# EAGLE design SmartCitizen DVK (EAGLE 6.6.0)

## Sheet 1 of 2
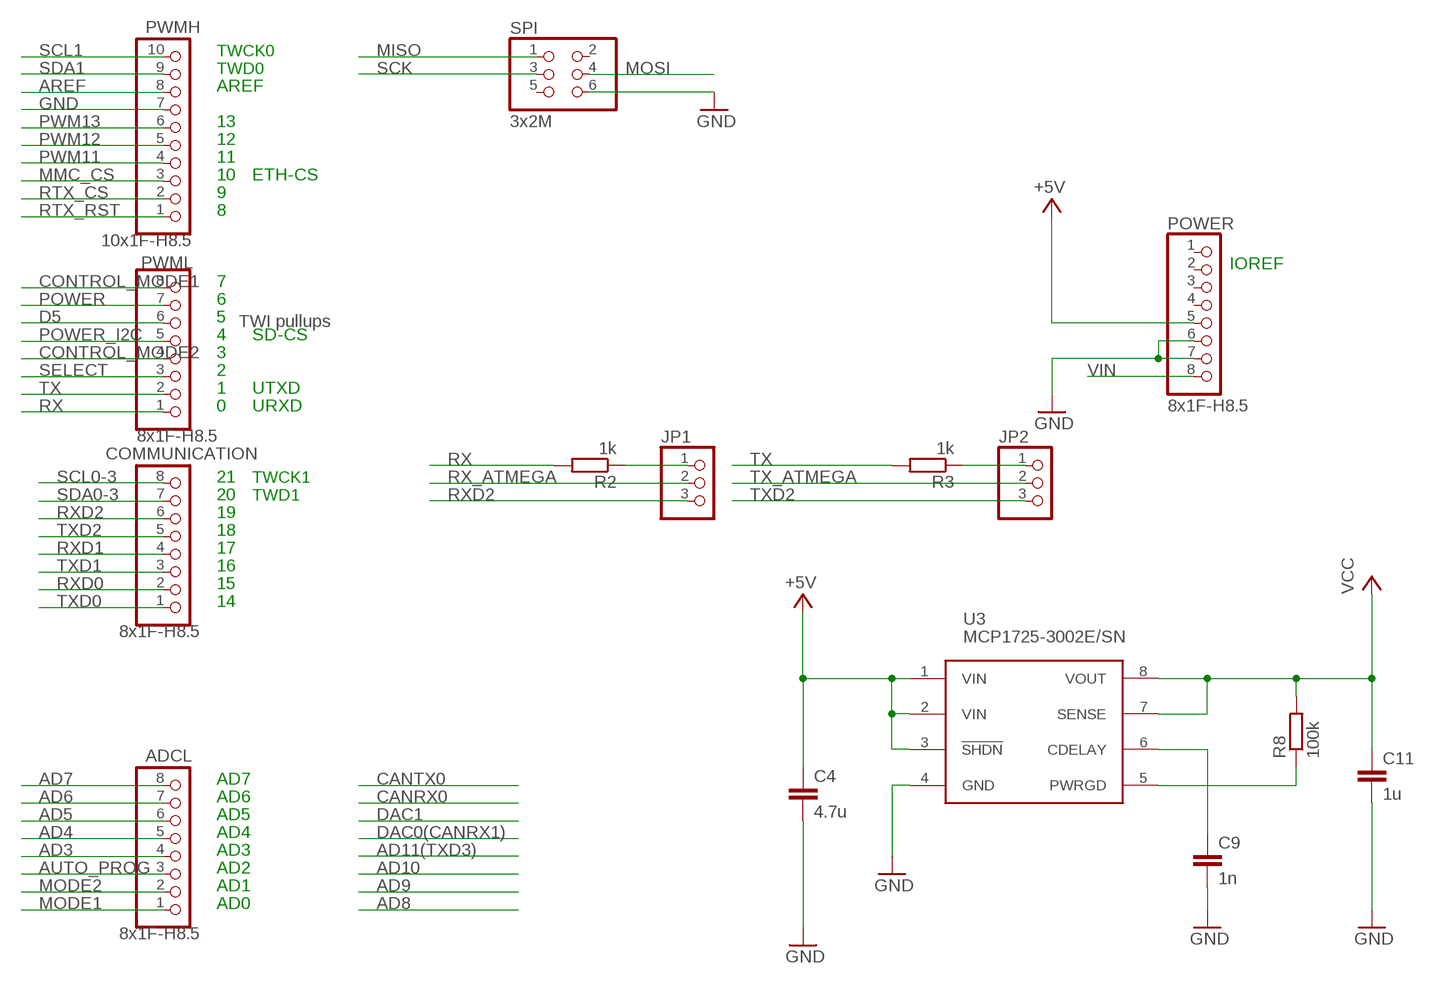
[diagram p0: schematic, sheet 1]

### Parts
ADCL  8x1F-H8.5  PINHD-1X8  [1X08]
C4  4.7u  C-EUC0805  [C0805]
C9  1n  C-EUC0805  [C0805]
C11  1u  C-EUC0805  [C0805]
COMMUNICATION  8x1F-H8.5  PINHD-1X8  [1X08]
JP1  PINHD-1X3  [1X03]
JP2  PINHD-1X3  [1X03]
POWER  8x1F-H8.5  PINHD-1X8  [1X08]
PWMH  10x1F-H8.5  PINHD-1X10  [1X10]
PWML  8x1F-H8.5  PINHD-1X8  [1X08]
R2  1k  R-EU_R0805  [R0805]
R3  1k  R-EU_R0805  [R0805]
R8  100k  R-EU_R0805  [R0805]
SPI  3x2M  PINHD-2X3  [2X03]
U3  MCP1725-3002E/SN  MCP1725  [SOIC8]

### Nets
+5V: C4.1 POWER.5 U3.1(VIN) U3.2(VIN) U3.3(!SHDN) ; also sheet 2
AD3: ADCL.4
AD4: ADCL.5
AD5: ADCL.6
AD6: ADCL.7
AD7: ADCL.8
AREF: PWMH.8
AUTO_PROG: ADCL.3 ; also sheet 2
CONTROL_MODE1: PWML.8 ; also sheet 2
CONTROL_MODE2: PWML.4 ; also sheet 2
D5: PWML.6
GND: C4.2 C9.2 C11.2 POWER.6 POWER.7 PWMH.7 SPI.6 U3.4(GND) ; also sheet 2
MISO: SPI.1 ; also sheet 2
MMC_CS: PWMH.3 ; also sheet 2
MODE1: ADCL.1 ; also sheet 2
MODE2: ADCL.2 ; also sheet 2
MOSI: SPI.4 ; also sheet 2
N$6: JP1.1 R2.1
N$7: JP2.1 R3.1
N$9: C9.1 U3.6(CDELAY)
N$10: R8.1 U3.5(PWRGD)
POWER: PWML.7 ; also sheet 2
POWER_I2C: PWML.5 ; also sheet 2
PWM11: PWMH.4
PWM12: PWMH.5
PWM13: PWMH.6
RTX_CS: PWMH.2 ; also sheet 2
RTX_RST: PWMH.1 ; also sheet 2
RX: PWML.1 R2.2
RX_ATMEGA: JP1.2 ; also sheet 2
RXD0: COMMUNICATION.2
RXD1: COMMUNICATION.4
RXD2: COMMUNICATION.6 JP1.3
SCK: SPI.3 ; also sheet 2
SCL0-3: COMMUNICATION.8
SCL1: PWMH.10 ; also sheet 2
SDA0-3: COMMUNICATION.7
SDA1: PWMH.9 ; also sheet 2
SELECT: PWML.3 ; also sheet 2
TX: PWML.2 R3.2
TX_ATMEGA: JP2.2 ; also sheet 2
TXD0: COMMUNICATION.1
TXD1: COMMUNICATION.3
TXD2: COMMUNICATION.5 JP2.3
VCC [usbvcc]: C11.1 R8.2 U3.7(SENSE) U3.8(VOUT) ; also sheet 2
VIN: POWER.8
Unconnected: POWER.1 POWER.2 POWER.3 POWER.4 SPI.2 SPI.5

### Notes on the sheet
- TWCK0
- TWD0
- AREF
- 13
- 12
- 11
- 10 | ETH-CS
- 9
- 8
- IOREF
- 7
- 6
- 5 | TWI pullups
- 4 | SD-CS
- 3
- 2
- 1 | UTXD
- 0 | URXD
- 21 | TWCK1
- 20 | TWD1
- 19
- 18
- 17
- 16
- 15
- 14
- AD7
- AD6
- AD5
- AD4
- AD3
- AD2
- AD1
- AD0

## Sheet 2 of 2
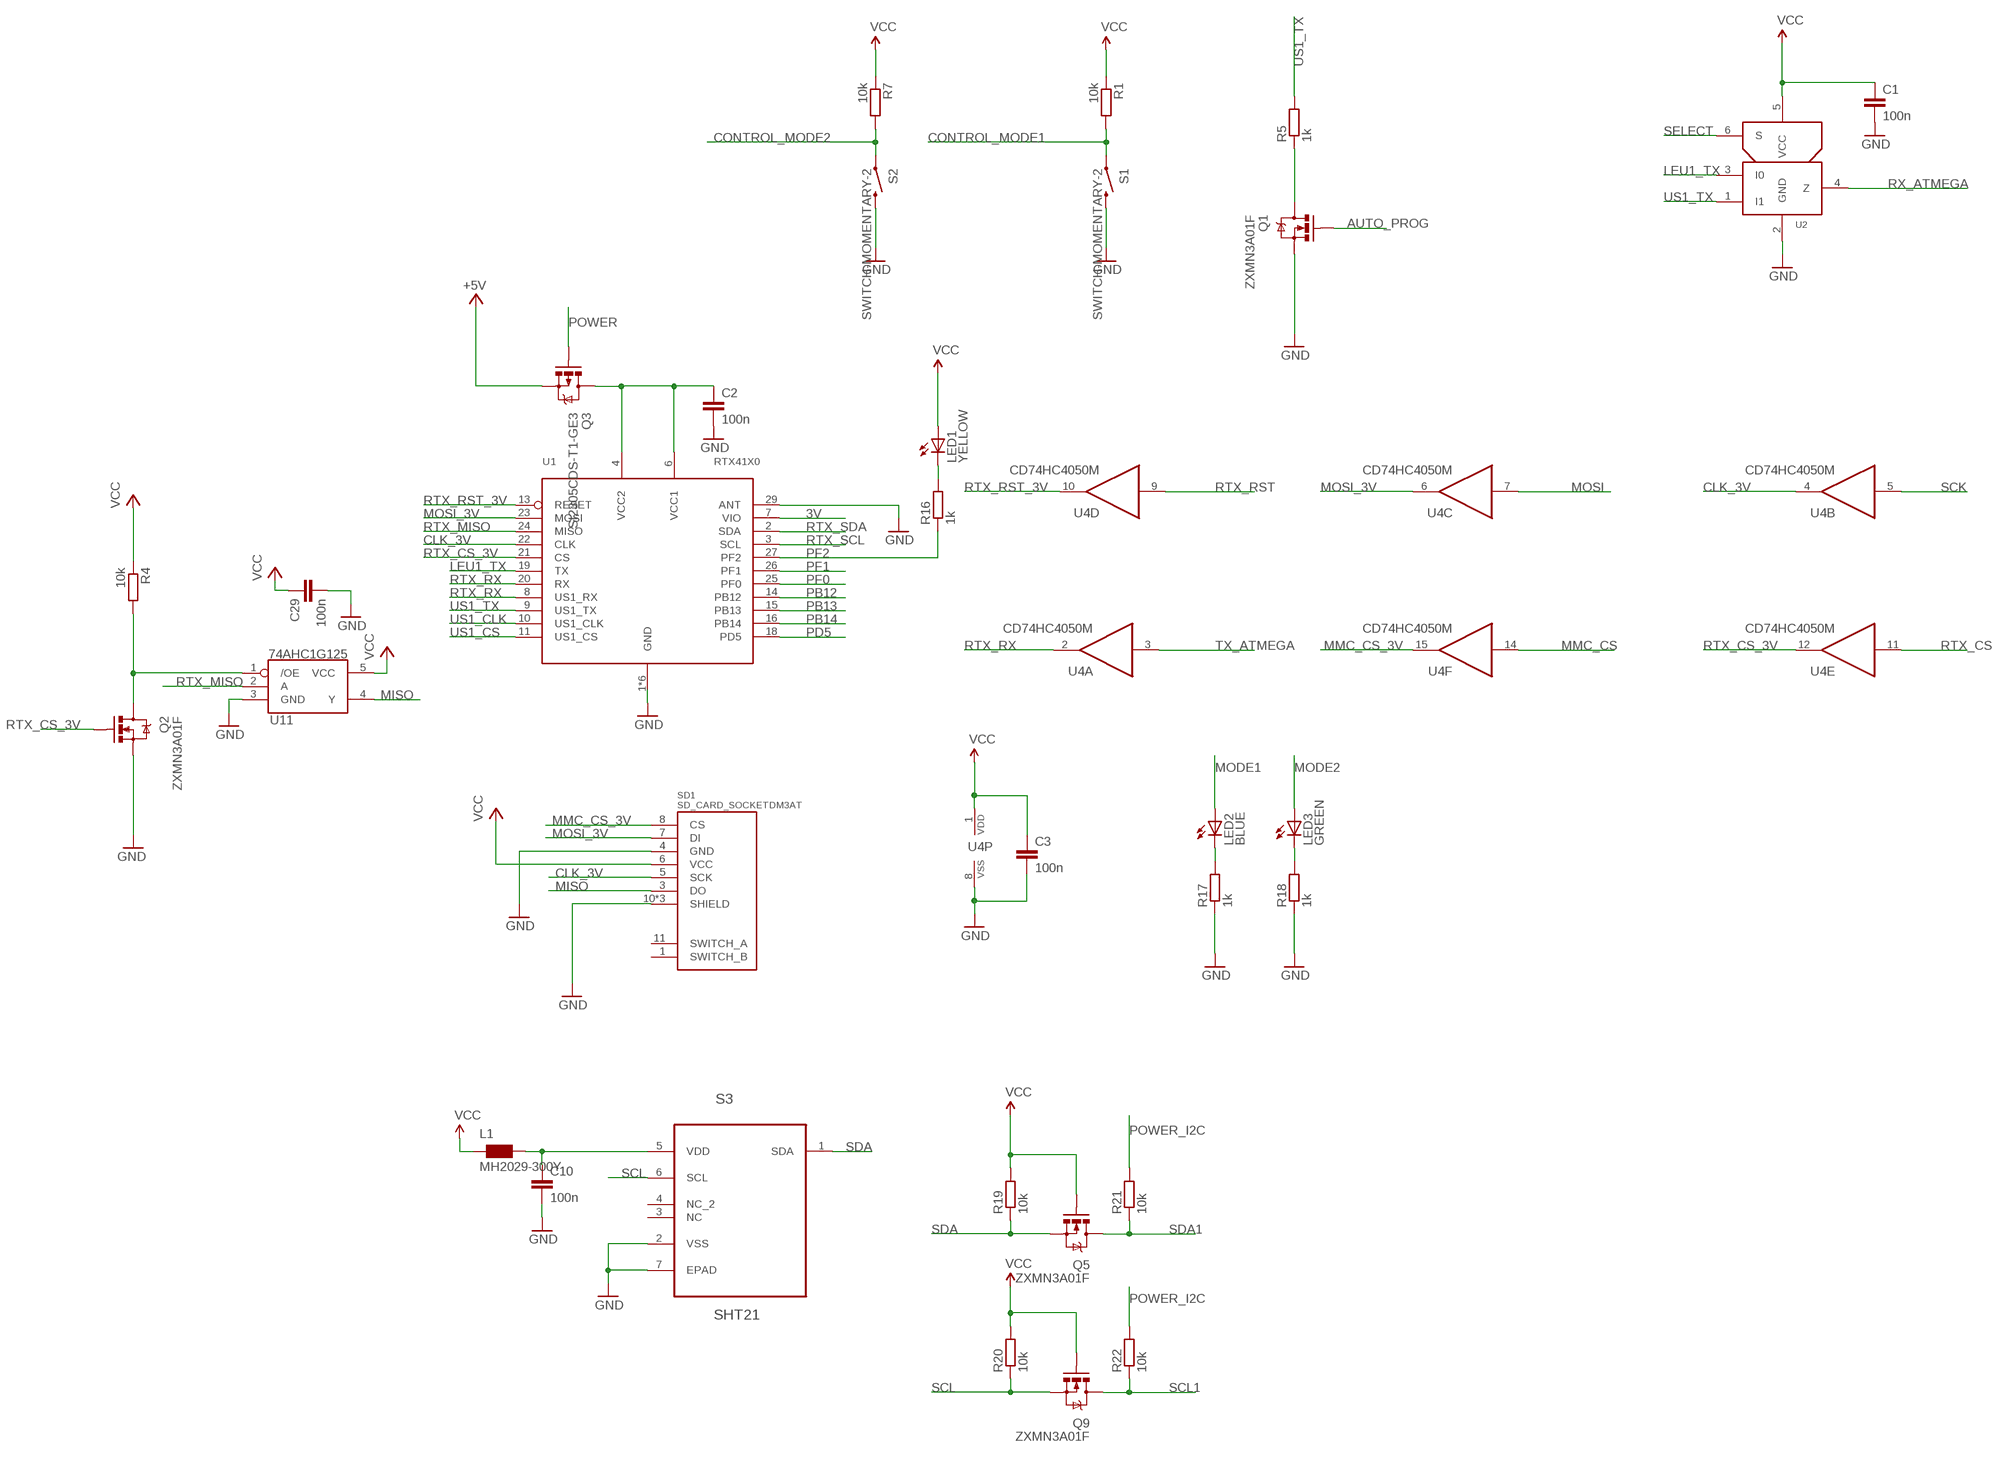
[diagram p1: schematic, sheet 2]

### Parts
C1  100n  C-EUC0805  [C0805]
C2  100n  C-EUC0805  [C0805]
C3  100n  C-EUC0805  [C0805]
C10  100n  C-EUC0805  [C0805]
C29  100n  C-EUC0805  [C0805]
L1  MH2029-300Y  WE-CBF_0805  [0805]
LED1  YELLOW  LEDCHIPLED_0805  [CHIPLED_0805]
LED2  BLUE  LEDCHIPLED_0805  [CHIPLED_0805]
LED3  GREEN  LEDCHIPLED_0805  [CHIPLED_0805]
Q1  ZXMN3A01F  MOSFET-NCHANNELBSS123LT1G  [SOT23]
Q2  ZXMN3A01F  MOSFET-NCHANNELBSS123LT1G  [SOT23]
Q3  SI2305CDS-T1-GE3  MOSFET-PCHANNEL  [SOT23-3]
Q5  ZXMN3A01F  MOSFET-NCHANNELBSS123LT1G  [SOT23]
Q9  ZXMN3A01F  MOSFET-NCHANNELBSS123LT1G  [SOT23]
R1  10k  R-EU_R0805  [R0805]
R4  10k  R-EU_R0805  [R0805]
R5  1k  R-EU_R0805  [R0805]
R7  10k  R-EU_R0805  [R0805]
R16  1k  R-EU_R0805  [R0805]
R17  1k  R-EU_R0805  [R0805]
R18  1k  R-EU_R0805  [R0805]
R19  10k  R-EU_R0805  [R0805]
R20  10k  R-EU_R0805  [R0805]
R21  10k  R-EU_R0805  [R0805]
R22  10k  R-EU_R0805  [R0805]
S1  SWITCH-MOMENTARY-2  [TACTILE_SWITCH_TALL]
S2  SWITCH-MOMENTARY-2  [TACTILE_SWITCH_TALL]
S3  SHT21  [DFN300X300X110-7N]
SD1  SD_CARD_SOCKETDM3AT  [DM3AT]
U1  RTX41X0  [RTX41X0]
U2  NC7SZ157P6X  NC7SV157  [SC70]
U4  CD74HC4050M  4050D  [SO16]
U11  74AHC1G125  [SOT23-5]

### Nets
3V: U1.7(VIO)
+5V: Q3.2(S) ; also sheet 1
AUTO_PROG: Q1.1(G) ; also sheet 1
CLK_3V: SD1.5(SCK) U1.22(CLK) U4.4(B:O)
CONTROL_MODE1: R1.2 S1.A2 ; also sheet 1
CONTROL_MODE2: R7.2 S2.A2 ; also sheet 1
GND: C1.2 C2.2 C3.2 C10.2 C29.2 Q1.2(S) Q2.2(S) R17.1 R18.1 S1.B2 S2.B2 S3.2(VSS) S3.7(EPAD) SD1.4(GND) SD1.10(SHIELD) SD1.12(SHIELD) SD1.13(SHIELD) U1.1(GND) U1.5(GND) U1.12(GND) U1.17(GND) U1.28(GND) U1.29(ANT) U1.30(GND) U2.2(GND) U4.8(P:VSS) U11.3(GND) ; also sheet 1
LEU1_TX: U1.19(TX) U2.3(I0)
MISO: SD1.3(DO) U11.4(Y) ; also sheet 1
MMC_CS: U4.14(F:I) ; also sheet 1
MMC_CS_3V: SD1.8(CS) U4.15(F:O)
MODE1: LED2.A ; also sheet 1
MODE2: LED3.A ; also sheet 1
MOSI: U4.7(C:I) ; also sheet 1
MOSI_3V: SD1.7(DI) U1.23(MOSI) U4.6(C:O)
N$1: Q1.3(D) R5.1
N$2: LED1.C R16.2
N$3: LED2.C R17.2
N$4: LED3.C R18.2
N$5 [usbvcc]: C10.1 L1.2 S3.5(VDD)
N$8: Q2.3(D) R4.2 U11.1(/OE)
PB12: U1.14(PB12)
PB13: U1.15(PB13)
PB14: U1.16(PB14)
PD5: U1.18(PD5)
PF0: U1.25(PF0)
PF1: U1.26(PF1)
PF2: R16.1 U1.27(PF2)
POWER: Q3.1(G) ; also sheet 1
POWER_I2C: R21.2 R22.2 ; also sheet 1
RTX_CS: U4.11(E:I) ; also sheet 1
RTX_CS_3V: Q2.1(G) U1.21(CS) U4.12(E:O)
RTX_MISO: U1.24(MISO) U11.2(A)
RTX_RST: U4.9(D:I) ; also sheet 1
RTX_RST_3V: U1.13(RESET) U4.10(D:O)
RTX_RX: U1.8(US1_RX) U1.20(RX) U4.2(A:O)
RTX_SCL: U1.3(SCL)
RTX_SDA: U1.2(SDA)
RX_ATMEGA: U2.4(Z) ; also sheet 1
SCK: U4.5(B:I) ; also sheet 1
SCL: Q9.2(S) R20.1 S3.6(SCL)
SCL1: Q9.3(D) R22.1 ; also sheet 1
SDA: Q5.2(S) R19.1 S3.1(SDA)
SDA1: Q5.3(D) R21.1 ; also sheet 1
SELECT: U2.6(S) ; also sheet 1
TX_ATMEGA: U4.3(A:I) ; also sheet 1
US1_CLK: U1.10(US1_CLK)
US1_CS: U1.11(US1_CS)
US1_TX: R5.2 U1.9(US1_TX) U2.1(I1)
VCC [usbvcc]: C1.1 C3.1 C29.1 L1.1 LED1.A Q5.1(G) Q9.1(G) R1.1 R4.1 R7.1 R19.2 R20.2 SD1.6(VCC) U2.5(VCC) U4.1(P:VDD) U11.5(VCC) ; also sheet 1
VCC2: C2.1 Q3.3(D) U1.4(VCC2) U1.6(VCC1)
Unconnected: S3.3(NC) S3.4(NC_2) SD1.1(SWITCH_B) SD1.11(SWITCH_A)

### Notes on the sheet
- SD CARD

## Library data of the parts
ADCL COMMUNICATION POWER PWML = SmartPrj:PINHD-1X8: PIN HEADER
C1-C3 = Hangar:C-EU: CAPACITOR, European symbol
C4 C9-C11 C29 = rcl:C-EU: CAPACITOR, European symbol
JP1 JP2 = pinhead:PINHD-1X3: PIN HEADER
L1 = wuerth-elektronik:WE-CBF: SMD EMI Suppression Ferrite Beads - excellent anti-EMI properties - low DCR - impedances till 3000 ohms - rated current up to 6 A
LED1-LED3 = led:LED: LED OSRAM: - CHIPLED LG R971, LG N971, LY N971, LG Q971, LY Q971, LO R971, LY R971 LH N974, LH R974 LS Q976, LO Q976, LY Q976 LO Q996 - Hyper CHIPLED LW Q18S LB Q993, LB Q99A, LB R99A - SideLED LS A670, LO A670, LY A670, LG A670, LP A670 LB A673, LV A673, LT A673, LW A673 LH A674 LY A675 LS A676, LA A676, LO A676, LY A676, LW A676 LS A679, LY A679, LG A679 - Hyper Micro SIDELED® LS Y876, LA Y876, LO Y876, LY Y876 LT Y87S - SmartLED LW L88C, LW L88S LB L89C, LB L89S, LG L890 LS L89K, LO L89K, LY L89K LS L896, LA L896, LO L896, LY L896 - TOPLED LS T670, LO T670, LY T670, LG T670, LP T670 LSG T670, LSP T670, LSY T670, LOP T670, LYG T670 LG T671, LOG T671, LSG T671 LB T673, LV T673, LT T673, LW T673 LH T674 LS T676, LA T676, LO T676, LY T676, LB T676, LH T676, LSB T676, LW T676 LB T67C, LV T67C, LT T67C, LS T67K, LO T67K, LY T67K, LW E67C LS E67B, LA E67B, LO E67B, LY E67B, LB E67C, LV E67C, LT E67C LW T67C LS T679, LY T679, LG T679 LS T770, LO T770, LY T770, LG T770, LP T770 LB T773, LV T773, LT T773, LW T773 LH T774 LS E675, LA E675, LY E675, LS T675 LS T776, LA T776, LO T776, LY T776, LB T776 LHGB T686 LT T68C, LB T68C - Hyper Mini TOPLED® LB M676 - Mini TOPLED Santana® LG M470 LS M47K, LO M47K, LY M47K Source: http://www.osram.convergy.de LUXEON: - LUMILED® LXK2-PW12-R00, LXK2-PW12-S00, LXK2-PW14-U00, LXK2-PW14-V00 LXK2-PM12-R00, LXK2-PM12-S00, LXK2-PM14-U00 LXK2-PE12-Q00, LXK2-PE12-R00, LXK2-PE12-S00, LXK2-PE14-T00, LXK2-PE14-U00 LXK2-PB12-K00, LXK2-PB12-L00, LXK2-PB12-M00, LXK2-PB14-N00, LXK2-PB14-P00, LXK2-PB14-Q00 LXK2-PR12-L00, LXK2-PR12-M00, LXK2-PR14-Q00, LXK2-PR14-R00 LXK2-PD12-Q00, LXK2-PD12-R00, LXK2-PD12-S00 LXK2-PH12-R00, LXK2-PH12-S00 LXK2-PL12-P00, LXK2-PL12-Q00, LXK2-PL12-R00 Source: www.luxeon.com KINGBRIGHT: KA-3528ASYC Source: www.kingbright.com
PWMH = SmartPrj:PINHD-1X10: PIN HEADER
Q1 Q2 Q5 Q9 = SparkFun-DiscreteSemi:MOSFET-NCHANNEL: Common NMOSFET Parts MFG P/N Store ID Prod ID FDD8780 TRANS-09984 SI7820DN TRANS-11055 FDS6630A IC-08089 2N7002PW TRANS-11151 FQP30N06L COM-10213 TRANS-10060 BSS123LT1G TRANS-08345 BSS138 TRANS-00830 BS170 2N7000; PROD_ID: TRANS-08345
Q3 = SparkFun-DiscreteSemi:MOSFET-PCHANNEL: Generic PMOSFET IRLML2244 - TRANS-11153 (SOT-23 -20V -4.3A) (1.Gate 2.Source 3.Drain) FQP27P06 - COM-10349 <http://www.sparkfun.com/products/10349> (TO-220 -60V -27A) (1.Gate 2.Source 3.Drain); PROD_ID: TRANS-08285
R1-R5 R7 R8 R16-R22 = rcl:R-EU_: RESISTOR, European symbol
S1 S2 = Hangar:SWITCH-MOMENTARY-2
S3 = Hangar:SHT21: SENSOR, HUMIDITY & TEMP; MPN: SHT21; OC_FARNELL: 1855468; OC_NEWARK: 20T1172; PACKAGE: DFN-6; SUPPLIER: SENSIRION
SD1 = Hangar:SD_CARD_SOCKET: SD/MMC Socket Media socket for SD and MMC cards. Push-push type. Model MOLEX 503182-0853
SPI = SmartPrj:PINHD-2X3: PIN HEADER
U1 = Hangar:RTX41X0
U2 = Hangar:NC7SV157
U3 = Hangar:MCP1725
U4 = 40xx:4050: Hex non-inverting BUFFER
U11 = SparkFun-DigitalIC:74AHC1G125: Single bus buffer gate with 3-state output

## Net classes
0 Default: width 0.254 mm
1 power: width 0.406 mm, drill 0.6 mm, clearance 0.203 mm
2 gnd: width 0.203 mm, drill 0.406 mm, clearance 0.203 mm
3 usbvcc: width 0.254 mm, drill 0.6 mm, clearance 0.203 mm
4 USBpair: width 0.254 mm, drill 0.406 mm, clearance 0.61 mm

## Board
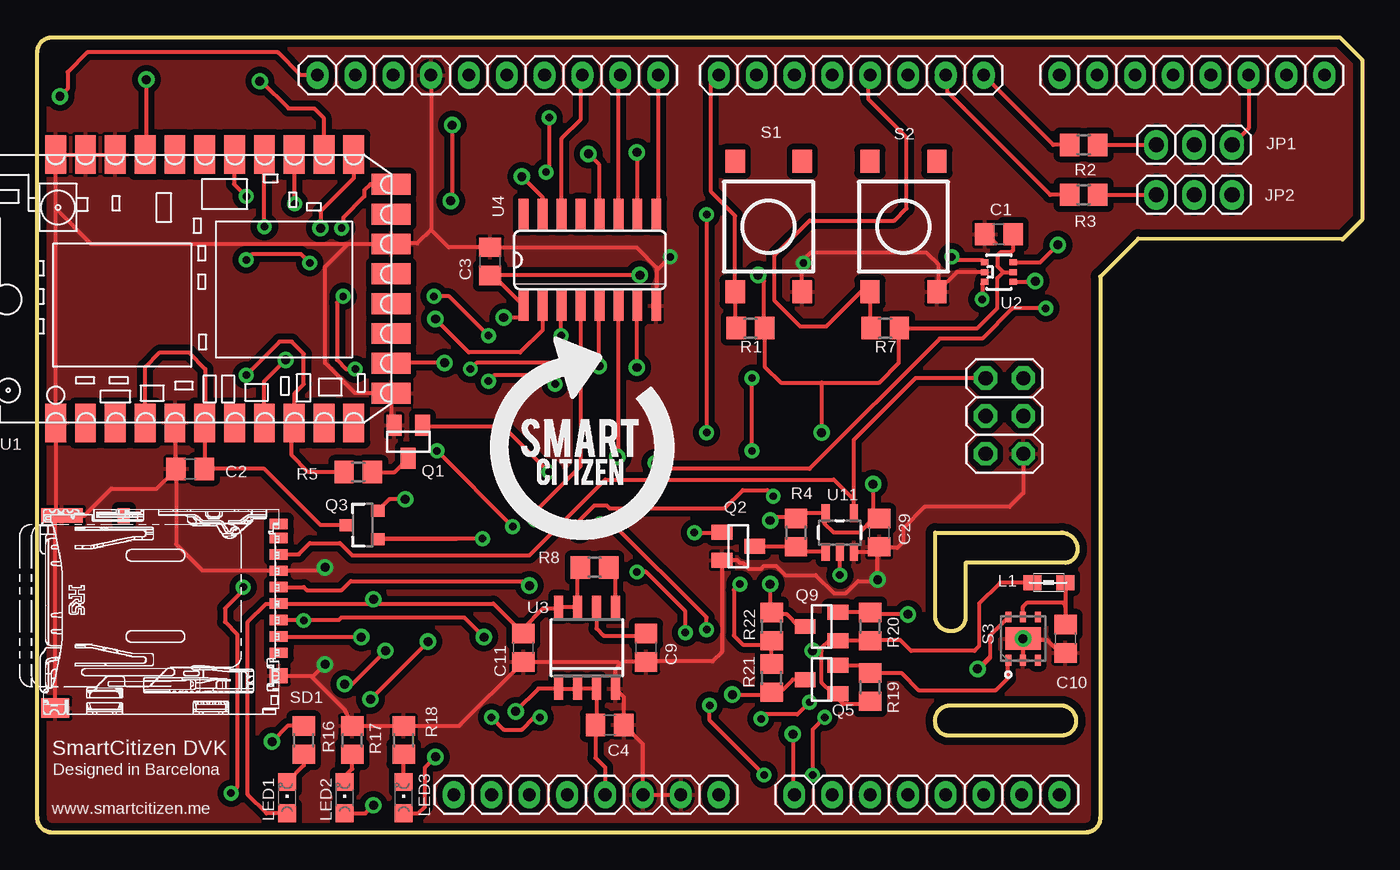
[diagram p2: board, top side]
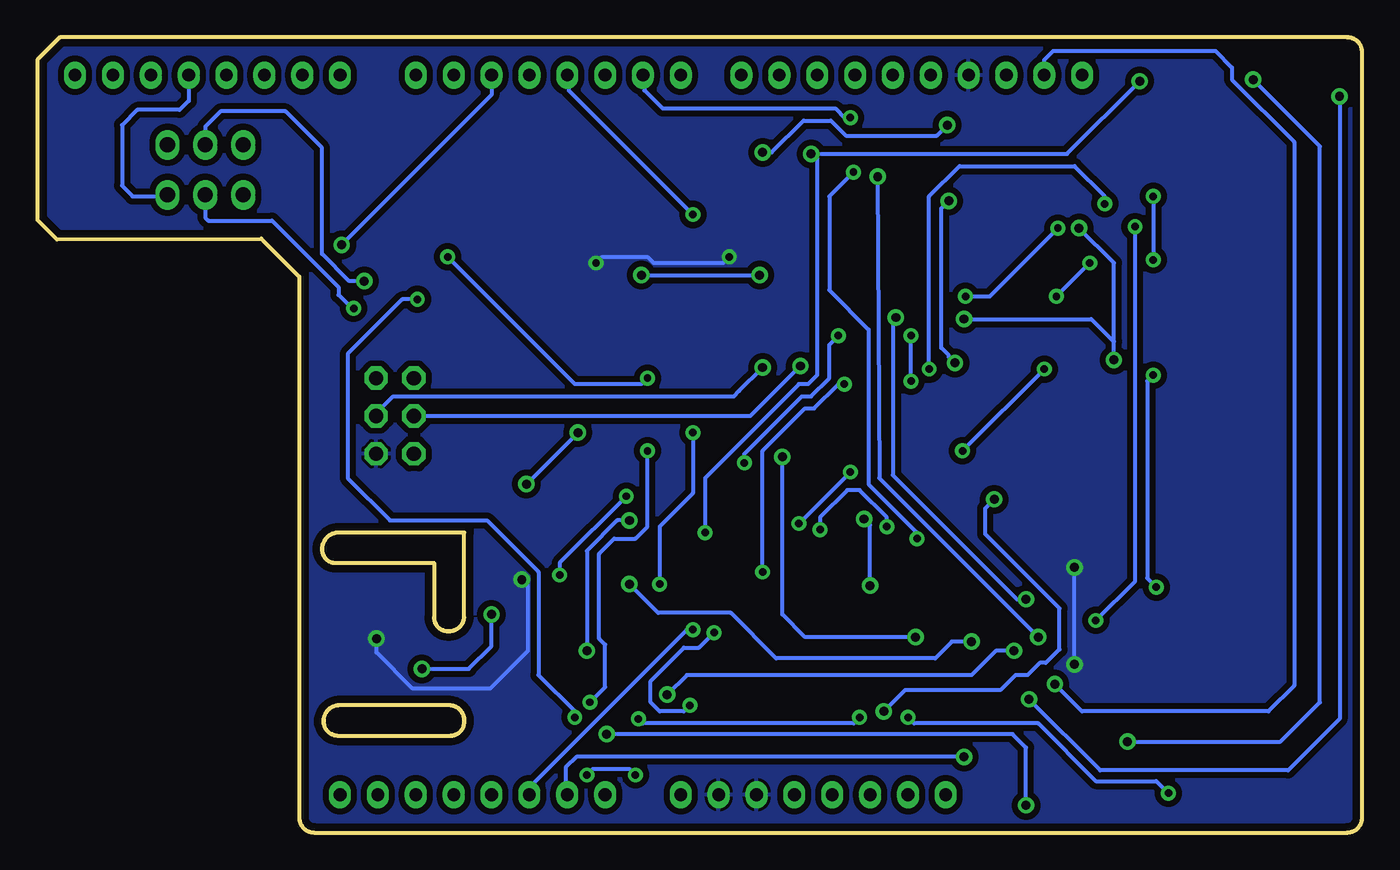
[diagram p3: board, bottom side, seen from below]

Size 88.9 x 53.34 mm. Coordinates in mm from the lower left corner, seen from the top.
Outline: 87.38,53.34 88.9,51.82 88.9,41.1 87.58,39.78 73.86,39.83 71.32,37.29 71.32,1 arc-90 70.32,0 1,0 arc-90 0,1 0,52.34 arc-90 1,53.34 87.38,53.34
Outline: 68.78,6.5 61.16,6.5 arc-90 60.25,7.42 arc-90 61.16,8.53 68.68,8.53 arc-90 69.7,7.42 arc-83 68.78,6.5
Outline: 68.99,18.09 62.28,18.09 62.28,14.43 arc-90 61.37,13.51 arc-90 60.25,14.43 60.25,20.12 68.68,20.12 arc-90 69.8,19 arc-83 68.99,18.09
Copper layers (1*16): Top 0.035mm / dielectric 1.6mm / Bottom 0.035mm
Design rules "default *": minimum track width 10mil, minimum drill 0.5mm, track to track 16mil, track to pad 16mil, pad to pad 16mil, via to via 16mil, smd to smd 16mil, copper to edge 20mil, drill to drill 12mil, minimum pad ring 12mil, minimum via ring 0.25mm, stop-mask expansion 2mil, vias tented up to drill 25mil, thermal gap 8mil

### Footprints (pad centres in the part's own frame; a part is rotated, then mirrored left to right if it is on the bottom)
1X08 = drill 0.85 pad 1.422 long: 1 -8.89,0; 2 -6.35,0; 3 -3.81,0; 4 -1.27,0; 5 1.27,0; 6 3.81,0; 7 6.35,0; 8 8.89,0
C0805 = smd 1.3 x 1.5: 1 -0.95,0; 2 0.95,0
1X03 = drill 1.016 long: 1 -2.54,0; 2 0,0; 3 2.54,0
0805 = smd 1.2 x 1: 1 -1.1,0; 2 1.1,0
CHIPLED_0805 = smd 1.2 x 1.2: A 0,-1.05; C 0,1.05
1X10 = drill 0.85 pad 1.422 long: 1 -11.43,0; 2 -8.89,0; 3 -6.35,0; 4 -3.81,0; 5 -1.27,0; 6 1.27,0; 7 3.81,0; 8 6.35,0; 9 8.89,0; 10 11.43,0
SOT23 = smd 1 x 1.4: 1 -0.95,-1.1; 2 0.95,-1.1; 3 0,1.1
SOT23-3 = smd 0.8 x 0.9: 1 -0.95,-1; 2 0.95,-1; 3 0,1.1
R0805 = smd 1.3 x 1.5: 1 -0.95,0; 2 0.95,0
TACTILE_SWITCH_TALL = smd 1.55 x 1.3: A1 -4.375,-2.25; A2 4.375,-2.25; B1 -4.375,2.25; B2 4.375,2.25
DFN300X300X110-7N = smd 0.711 x 0.406: 1 -1.448,0.991; 2 -1.448,0; 3 -1.448,-0.991; 4 1.448,-0.991; 5 1.448,0; 6 1.448,0.991 | smd 1.499 x 2.388: 7 0,0
DM3AT = smd 0.7 x 1.2: 1 -5.875,7.975; 2 -4.925,7.975; 3 -3.825,7.975; 4 -2.725,7.975; 5 -1.625,7.975; 6 -0.525,7.975; 7 0.575,7.975; 8 1.675,7.975; 9 2.775,7.975 | smd 1 x 1.2: 10 4.33,7.975 | smd 1 x 0.8: 11 -6.425,-2.425 | smd 1 x 2.8: 12 -6.43,-6.575 | smd 1.3 x 1.9: 13 6.49,-7.02
2X03 = drill 0.95 pad 1.55 octagon: 1 -2.54,-1.27; 2 -2.54,1.27; 3 0,-1.27; 4 0,1.27; 5 2.54,-1.27; 6 2.54,1.27
RTX41X0 = smd 1.4 x 2.6: 1 7.5,9; 2 5.5,9; 3 3.5,9; 4 1.5,9; 5 -0.5,9; 6 -2.5,9; 7 -4.5,9; 8 -6.5,9; 9 -8.5,9; 10 -10.5,9; 11 -12.5,9; 20 -12.5,-9; 21 -10.5,-9; 22 -8.5,-9; 23 -6.5,-9; 24 -4.5,-9; 25 -2.5,-9; 26 -0.5,-9; 27 1.5,-9; 28 3.5,-9; 29 5.5,-9; 30 7.5,-9 | smd 2.6 x 1.4: 12 -15,7; 13 -15,5; 14 -15,3; 15 -15,1; 16 -15,-1; 17 -15,-3; 18 -15,-5; 19 -15,-7
SC70 = smd 0.4 x 0.5: 1 -0.65,-0.95; 2 0,-0.95; 3 0.65,-0.95; 4 0.65,0.95; 5 0,0.95; 6 -0.65,0.95
SOIC8 = smd 0.6 x 1.5: 1 -1.905,-2.75; 2 -0.635,-2.75; 3 0.635,-2.75; 4 1.905,-2.75; 5 1.905,2.75; 6 0.635,2.75; 7 -0.635,2.75; 8 -1.905,2.75
SO16 = smd 0.66 x 2.032: 1 -4.445,-3.073; 2 -3.175,-3.073; 3 -1.905,-3.073; 4 -0.635,-3.073; 5 0.635,-3.073; 6 1.905,-3.073; 7 3.175,-3.073; 8 4.445,-3.073; 9 4.445,3.073; 10 3.175,3.073; 11 1.905,3.073; 12 0.635,3.073; 13 -0.635,3.073; 14 -1.905,3.073; 15 -3.175,3.073; 16 -4.445,3.073
SOT23-5 = smd 0.55 x 1.2: 1 -0.95,-1.3; 2 0,-1.3; 3 0.95,-1.3; 4 0.95,1.3; 5 -0.95,1.3

### Placement (x,y rotation side)
ADCL  59.69,2.54 0 top
C1  64.52,40.13 180 top
C2  10.26,24.38 180 top
C3  30.38,38.3 90 top
C4  38.4,7.21 0 top
C9  40.84,12.4 270 top
C10  68.99,13 270 top
C11  32.61,12.4 270 top
C29  56.49,20.12 270 top
COMMUNICATION  77.47,50.8 0 top
JP1  77.62,46.13 0 top
JP2  77.62,42.77 0 top
L1  67.87,16.76 0 top
LED1  16.76,2.34 0 top
LED2  20.62,2.34 0 top
LED3  24.59,2.34 0 top
POWER  36.83,2.54 0 top
PWMH  30.23,50.8 180 top
PWML  54.61,50.8 180 top
Q1  24.89,26.21 180 top
Q2  47.04,19.2 270 top
Q3  21.84,20.62 90 top
Q5  52.63,10.26 90 top
Q9  52.63,13.82 90 top
R1  47.85,33.83 180 top
R2  70.21,46.13 180 top
R3  70.21,42.77 180 top
R4  50.9,20.12 270 top
R5  21.54,24.18 180 top
R7  56.9,33.83 180 top
R8  37.39,17.78 180 top
R16  17.88,6.2 270 top
R17  21.13,6.2 270 top
R18  24.59,6.2 270 top
R19  55.88,9.75 270 top
R20  55.88,13.82 270 top
R21  49.28,10.36 90 top
R22  49.28,13.82 270 top
S1  49.07,40.64 270 top
S2  58.12,40.64 270 top
S3  66.14,13 90 top
SD1  8.23,14.83 270 top
SPI  64.9,27.94 270 top
U1  8.74,36.47 180 top
U2  64.52,37.59 270 top
U3  36.88,12.4 0 top
U4  37.08,38.4 0 top
U11  53.85,20.12 0 top

### Tracks (layer width: path | path; a pad name or v marks a point on that pad's centre or on a via)
+5V  (via drill 0.6)
  Top 0.254: POWER.5 38.1,4.37 37.45,5.01 C4.1 37.52,7.28 U3.3 U3.2 U3.1 33.62,9.64 v32.11,8.13 | v24.69,22.35 23.62,22.35 Q3.2
  Bottom 0.254: v24.69,22.35 25.3,21.74 25.3,20.02 20.32,15.04 20.32,12.29 21.23,11.38 21.64,11.38 22.45,10.57 23.27,10.57 24.28,9.55 30.68,9.55 v32.11,8.13
AUTO_PROG  (via drill 0.5)
  Top 0.254: v34.34,24.18 31.29,27.23 26.01,27.23 Q1.1 | v37.8,20.73 38.61,20.73 44.91,14.43 v44.91,13.61
  Bottom 0.254: v37.8,20.73 v34.34,24.18 | v44.91,13.61 45.31,13.61 55.88,3.05 ADCL.3
CLK_3V  (via drill 0.5, 0.6)
  Top 0.254: v33.43,21.03 33.43,21.54 36.45,24.56 36.45,31.5 | U4.4 36.45,31.5 | SD1.5 17.88,16.46 18.09,16.26 20.42,16.26 21.03,16.87 32.72,16.87 v33.02,16.56 | v17.27,42.16 17.27,45.31 U1.22 | v29.06,31.09 29.46,31.5 36.45,31.5
  Bottom 0.254: v33.02,16.56 33.02,20.62 v33.43,21.03 | v29.06,31.09 29.06,42.67 27.03,44.7 19.3,44.7 17.27,42.67 v17.27,42.16
CONTROL_MODE1
  Top 0.254: R1.2 46.82,33.91 S1.A2 46.82,41.37 45.21,42.98 45.21,50.29 PWML.8
CONTROL_MODE2
  Top 0.254: R7.2 55.87,33.91 S2.A2 55.26,36.27 52.93,33.93 51.21,33.93 49.48,35.66 49.48,38.71 51.82,41.05 57.51,41.05 58.32,41.86 58.32,46.63 55.78,49.17 55.78,50.7 PWML.4
GND  (via drill 0.5, 0.6)
  Top 0.254: S3.2 S3.7 66.24,12.9 67.77,12.9 68.52,12.15 C10.2 | C1.2 63.7,40.13 64.31,39.52 | S1.B2 51.32,38.2 | 51.32,38.2 51.32,38.32 51.92,38.91 59.64,38.91 60.45,38.1 60.45,36.35 S2.B2 61.69,37.59 U2.2 | SD1.13 1.21,20.82 1.62,21.23 | 1.24,41.86 U1.1 1.24,21.68 SD1.12 1.62,21.23 | 1.24,41.86 U1.30 U1.29 U1.28 | U1.5 9.24,24.46 C2.2 9.31,19.34 11.07,17.58 16.19,17.58 SD1.4 16.22,17.58 19.1,17.58 v19.3,17.78 | 39.12,11.28 38.79,10.95 U3.4 39.35,9.08 C4.2 40.64,5.93 POWER.6 POWER.7 | 39.12,11.28 39.32,11.48 40.81,11.48 C9.2 40.88,11.48 45.31,11.48 45.94,12.11 Q2.2 46.13,18.29 46.94,18.29 47.14,18.09 47.35,18.09 47.75,17.68 48.56,17.68 48.77,17.88 49.58,17.88 50.19,17.27 52.22,17.27 53.44,16.05 54.25,16.05 55.07,16.87 56.29,16.87 v56.39,16.97 56.39,19.07 C29.2 | 39.12,11.28 38.95,11.45 C11.2 28.32,7.15 R18.1 R17.1 20.62,8.23 18.35,10.5 SD1.10 18.53,10.5 v19.3,11.28 | PWMH.7 26.42,40.44 | 26.42,40.44 25.5,39.52 23.79,39.52 U1.17 20.83,39.47 | 20.83,39.47 3.62,39.47 1.24,41.86 | Q1.2 23.74,27.52 U1.12 21.33,29.47 19.3,31.5 19.3,37.95 20.83,39.47 | 26.42,40.44 27.6,39.25 C3.2 40.2,39.25 41.55,37.9 41.55,37.8 | 41.55,37.8 41.55,35.36 U4.8 | U11.3 56.14,18.82 C29.2 | SPI.6 66.17,22.78 65.23,21.84 59.54,21.84 58.12,20.42 58.12,19.51 57.71,19.1 56.56,19.1 C29.2 | v42.47,38.61 41.66,37.8 41.55,37.8 | v51.41,38.2 51.32,38.2 | 1.62,21.23 3.15,21.23 4.98,23.06 8.03,23.06 9.35,24.38
  Bottom 0.254: 66.14,12.6 S3.7 66.14,12.09 63.7,9.65 58.52,9.65 55.98,12.19 55.98,16.56 v56.39,16.97 | v19.3,11.28 v19.3,17.78 | v42.47,38.61 42.88,38.2 47.55,38.2 47.95,38.61 51,38.61 v51.41,38.2
  other vias: 66.14,13
  pour Top (isolate 0.305, rank 2): 89.81,54.15 89.81,-0.2 -1.02,-0.51 0,53.85
  pour Bottom (isolate 0.305, rank 2): -0.51,54.86 90.02,54.46 90.02,-1.93 -1.52,-1.52
LEU1_TX  (via drill 0.5)
  Top 0.254: v26.62,35.97 27.64,35.97 v30.28,33.33 | v30.28,30.28 30.68,30.68 34.14,30.68 v34.75,30.07 | v40.23,17.48 40.84,17.48 43.48,14.83 v43.48,13.41 | v45.11,8.53 45.11,7.52 v48.77,3.86 | v52.02,3.86 52.02,6.91 v52.83,7.72 | v63.4,35.76 63.4,36.78 U2.3 | U1.19 23.57,43.48 22.35,43.48 21.95,43.08 21.95,42.67 20.52,41.25 20.52,40.64 v20.42,40.54
  Bottom 0.254: v30.28,30.28 v30.28,33.33 | v34.75,30.07 35.15,30.07 36.78,28.45 37.39,28.45 40.23,25.6 v40.23,17.48 | v43.48,13.41 44.5,12.39 45.52,12.39 47.75,10.16 47.75,8.74 47.14,8.13 45.52,8.13 v45.11,8.53 | v48.77,3.86 49.17,4.27 51.61,4.27 v52.02,3.86 | v52.83,7.72 52.83,8.13 55.27,10.57 55.27,17.48 58.73,20.93 65.23,20.93 68.07,23.77 68.07,32.11 64.41,35.76 v63.4,35.76 | v26.62,35.97 24.99,35.97 v20.42,40.54
MISO
  Top 0.254: SPI.1 58.93,30.48 54.76,26.31 54.76,22.35 | 54.76,22.35 54.76,21.45 U11.4 | 54.76,22.35 53.44,23.67 38.1,23.67 33.02,18.59 21.13,18.59 20.32,19.41 18.29,19.41 17.54,18.66 SD1.3
MMC_CS
  Top 0.254: U4.14 35.18,46.56 36.47,47.85 36.47,50.7 PWMH.3
MMC_CS_3V  (via drill 0.6)
  Top 0.254: v21.74,13.11 16.26,13.11 SD1.8 | U4.15 33.91,42.6 v32.51,43.99
  Bottom 0.254: v32.51,43.99 32.41,23.77 v21.74,13.11
MODE1  (via drill 0.6)
  Top 0.254: LED2.A 22.01,1.29 v22.55,1.83 | v50.7,6.6 50.7,2.64 ADCL.1
  Bottom 0.254: v22.55,1.83 22.55,5.69 23.47,6.6 v50.7,6.6
MODE2  (via drill 0.6)
  Top 0.254: LED3.A 25.57,1.29 26.01,1.73 26.01,4.37 v26.72,5.08
  Bottom 0.254: v26.72,5.08 52.73,5.08 53.44,4.37 53.44,2.64 ADCL.2
MOSI  (via drill 0.6)
  Top 0.254: v40.23,31.19 40.23,35.31 U4.7
  Bottom 0.254: v40.23,31.19 41.81,29.62 42.16,29.26 65.02,29.26 66.17,28.12 SPI.4
MOSI_3V  (via drill 0.5, 0.6)
  Top 0.254: SD1.7 17.88,14.26 | 17.88,14.26 20.25,14.26 20.42,14.43 28.65,14.43 v29.97,13.11 | v38.91,25.2 38.91,25.6 39.01,25.7 39.01,35.31 U4.6 | v15.24,40.64 15.24,45.31 U1.23 | v17.88,14.22 17.88,14.26
  Bottom 0.254: v29.97,13.11 37.39,13.11 38.91,14.63 v38.91,25.2 | v15.24,40.64 15.24,16.87 v17.88,14.22
N$1
  Top 0.254: R5.1 23.96,24.18 Q1.3
N$2
  Top 0.254: R16.2 17.88,4.5 LED1.C
N$3
  Top 0.254: LED2.C 20.62,3.76 21.13,4.27 R17.2
N$4
  Top 0.254: LED3.C R18.2
N$5
  Top 0.254: 69.09,13.92 C10.1 68.99,15.14 | S3.5 66.14,15.14 66.45,15.44 68.78,15.44 68.99,15.24 68.99,15.14 | L1.2 68.97,15.16 68.99,15.14
N$6
  Top 0.254: R2.1 JP1.1
N$7
  Top 0.254: R3.1 JP2.1
N$8
  Top 0.254: U11.1 51.25,18.82 R4.2 48.18,19.17 Q2.3
N$9
  Top 0.254: U3.6 37.52,13.69 38,13.21 40.71,13.21 C9.1
N$10
  Top 0.254: U3.5 38.79,17.33 R8.1
PF2  (via drill 0.6)
  Top 0.254: R16.1 16.8,7.15 v15.75,6.1 | v7.32,50.49 7.32,45.55 U1.27
  Bottom 0.254: v15.75,6.1 5.49,6.1 2.85,8.74 2.85,46.02 v7.32,50.49
POWER  (via drill 0.5)
  Top 0.254: v29.87,19.71 28.14,19.71 | v34.14,44.3 34.34,44.5 v34.34,47.95
  Top 0.305: 28.14,19.71 22.84,19.71 Q3.1
  Bottom 0.254: v29.87,19.71 29.87,20.12 33.12,23.37 33.12,33.73 35.76,36.37 35.76,42.67 v34.14,44.3 | v34.34,47.95 34.75,47.95 35.36,48.56 46.94,48.56 48.16,49.78 48.16,50.8 PWML.7
POWER_I2C  (via drill 0.5)
  Top 0.254: R21.2 R22.2 49.17,12.6 47.35,12.6 46.74,13.21 46.74,16.26 v47.14,16.66 | v44.91,41.45 v44.91,26.82
  Bottom 0.254: v47.14,16.66 47.14,20.52 44.91,22.76 v44.91,26.82 | v44.91,41.45 53.24,49.78 53.24,50.8 PWML.5
RTX_CS
  Top 0.254: U4.11 38.99,50.67 PWMH.2
RTX_CS_3V  (via drill 0.5, 0.6)
  Top 0.254: U4.12 37.72,44.78 v36.98,45.52 | v14.94,50.39 15.04,50.39 16.87,48.56 18.59,48.56 19.2,47.95 19.2,45.51 U1.21 | v44.09,20.12 45.92,20.12 Q2.1
  Bottom 0.254: 36.58,45.52 19.81,45.52 v14.94,50.39 | v44.09,20.12 44.09,23.77 37.8,30.07 37.19,30.07 36.58,30.68 36.58,45.52 | 36.58,45.52 v36.98,45.52
RTX_MISO  (via drill 0.5)
  Top 0.254: v53.85,17.27 U11.2 | v49.38,22.55 48.97,22.96 47.35,22.96 46.13,21.74 38.41,21.74 38.2,21.95 37.39,21.95 36.37,20.93 v36.37,20.32 | v26.82,25.6 v31.9,20.52 | v21.34,31.09 20.73,31.09 20.12,31.7 20.12,35.56 v20.52,35.97 | v18.29,38.2 17.68,38.81 14.43,38.81 v14.02,38.41 | v14.02,42.67 13.21,43.48 13.21,45.31 U1.24
  Bottom 0.254: v53.85,17.27 53.85,18.09 v49.38,22.55 | v36.37,20.32 36.37,21.13 34.54,22.96 33.73,22.96 31.9,21.13 v31.9,20.52 | v21.34,31.09 v26.82,25.6 | v18.29,38.2 v20.52,35.97 | v14.02,42.67 v14.02,38.41
RTX_RST
  Top 0.254: PWMH.1 41.66,41.6 U4.9
RTX_RST_3V  (via drill 0.6)
  Top 0.254: U4.10 40.26,45.59 v40.23,45.62 | v27.84,47.45 27.84,42.47 v27.74,42.37 | v27.33,31.5 23.76,31.5 U1.13
  Bottom 0.254: v40.23,45.62 39.62,45.62 37.49,47.75 35.66,47.75 34.65,46.74 28.55,46.74 v27.84,47.45 | v27.33,31.5 27.74,31.9 27.74,32 28.25,32.51 28.25,41.86 v27.74,42.37
RTX_RX  (via drill 0.6)
  Top 0.254: U1.8 15.24,30.27 v16.66,31.7 | 20.93,45.17 U1.20 21.24,43.89 19,41.66 v19,40.54 | U4.2 33.91,33.71 32.41,32.21 28.96,32.21 v26.72,34.44
  Bottom 0.254: v16.66,31.7 16.66,32.92 | 16.66,32.92 16.66,38.2 v19,40.54 | v26.72,34.44 18.19,34.44 16.66,32.92
RX
  Top 0.254: R2.2 68.17,46.13 PWML.1
RX_ATMEGA  (via drill 0.6)
  Top 0.254: U2.4 66.91,36.94 v66.95,36.98
  Bottom 0.254: v66.95,36.98 67.97,36.98 69.8,38.81 69.8,45.92 72.24,48.36 76.61,48.36 77.62,47.35 JP1.2
RXD2
  Top 0.254: COMMUNICATION.6 81.28,47.24 JP1.3
SCK  (via drill 0.6)
  Top 0.254: v37.69,31.29 37.69,35.31 U4.5
  Bottom 0.254: SPI.3 41.05,27.94 v37.69,31.29
SCL  (via drill 0.6)
  Top 0.254: 63.91,11.79 63.91,11.68 63.5,11.28 | 63.91,11.79 63.91,13.21 S3.6 | 63.91,11.79 v63.09,10.97 | v58.42,14.63 56.02,14.63 R20.1 Q9.2
  Bottom 0.254: v63.09,10.97 59.94,10.97 58.42,12.5 v58.42,14.63
SCL1  (via drill 0.6)
  Top 0.254: Q9.3 51.1,13.82 50.29,14.63 49.34,14.63 R22.1 49.17,14.67 v49.17,16.66 | PWMH.10 17.68,50.8 16.15,52.32 3.35,52.32 2.03,51 2.03,49.89 v1.52,49.38 | v22.35,8.94 v26.21,12.8
  Bottom 0.254: v1.52,49.38 1.52,7.62 4.98,4.17 17.58,4.17 v22.35,8.94 | v26.21,12.8 27.53,12.8 28.65,11.68 39.32,11.68 42.37,14.73 47.24,14.73 v49.17,16.66
SDA
  Top 0.254: 65.1,11.56 S3.1 65.13,11.53 65.13,10.36 64.31,9.55 59.13,9.55 57.98,10.7 R19.1 55.37,11.21 Q5.2
SDA1  (via drill 0.6)
  Top 0.254: Q5.3 50.7,10.26 49.99,9.55 49.34,9.55 R21.1 48.91,9.25 v46.63,9.25 | v20.62,9.96 21.13,9.96 v23.37,12.19
  Bottom 0.254: PWMH.9 21.34,51.82 20.73,52.43 9.86,52.43 8.74,51.31 8.74,50.49 4.57,46.33 4.57,9.86 6.3,8.13 18.8,8.13 v20.62,9.96 | v23.37,12.19 24.59,12.19 26.21,10.57 45.31,10.57 v46.63,9.25
SELECT  (via drill 0.6)
  Top 0.254: U2.6 67.3,38.24 v68.48,39.42
  Bottom 0.254: PWML.3 58.42,49.48 v68.48,39.42
TX
  Top 0.254: R3.2 67.97,42.77 61.06,49.68 61.06,50.7 PWML.2
TX_ATMEGA  (via drill 0.5)
  Top 0.254: v35.15,33.33 35.15,35.15 U4.3 | v41.45,24.79 41.86,24.38 51.82,24.38 60.55,33.12 63.4,33.12 65.43,35.15 v67.67,35.15
  Bottom 0.254: JP2.2 77.62,41.25 77.42,41.05 73.15,41.05 68.68,36.58 68.68,36.07 67.77,35.15 v67.67,35.15 | v35.15,33.33 35.76,32.72 35.76,30.48 36.98,29.26 37.59,29.26 41.45,25.4 v41.45,24.79
TXD2
  Bottom 0.254: COMMUNICATION.5 78.74,49.07 79.35,48.46 82.19,48.46 83.21,47.45 83.21,43.38 82.5,42.67 80.26,42.67 JP2.3
US1_TX  (via drill 0.5)
  Top 0.254: R5.2 18.19,24.18 17.07,25.3 17.07,27.31 U1.9 17.27,27.64 17.27,29.46 17.88,30.07 17.88,32.11 17.07,32.92 16.26,32.92 v14.02,30.68 | v61.37,38.61 61.57,38.41 63.4,38.41 U2.1 | v47.95,25.6 v47.95,30.48 | v51.82,8.74 51,7.92 48.87,7.92 v48.56,7.62 | v33.73,7.72 33.33,7.72 32.51,6.91 31.29,6.91 v30.48,7.72 | v13.82,16.46 13.82,16.26 12.6,15.04 12.6,14.12 13.41,13.31 13.41,3.05 v13.01,2.64
  Bottom 0.254: v61.37,38.61 52.83,30.07 48.36,30.07 v47.95,30.48 | v47.95,25.6 47.95,20.52 48.77,19.71 50.19,19.71 51.21,18.69 51.21,13.01 50.8,12.6 50.8,9.75 v51.82,8.74 | v33.73,7.72 34.14,7.32 48.26,7.32 v48.56,7.62 | v30.48,7.72 30.07,7.32 21.74,7.32 17.88,3.45 13.82,3.45 v13.01,2.64 | v13.82,16.46 14.43,17.07 14.43,30.28 v14.02,30.68
VCC  (via drill 0.6)
  Top 0.254: LED1.A 15.38,1.29 14.12,2.54 14.12,14.12 15.34,15.34 16.19,15.34 SD1.6 | 16.12,15.44 SD1.6 | SD1.6 22.55,15.36 | 22.55,15.36 30.6,15.36 C11.1 32.61,13.72 33.93,15.04 34.87,15.04 U3.8 U3.7 36.25,17.59 R8.2 | 52.63,30.18 49.89,30.18 48.8,31.26 R1.1 48.77,33.93 48.77,36.98 v48.36,37.39 | 52.63,30.18 56.49,30.18 57.81,31.5 57.81,33.8 R7.1 63.09,33.83 64.41,35.15 64.41,37.19 64.82,37.59 | 52.63,12.19 52.63,10.06 53.38,9.31 Q5.1 53.73,8.96 54.05,8.64 55.71,8.64 R19.2 | 52.63,12.19 52.63,12.39 53.14,12.9 53.69,12.9 Q9.1 R20.2 55.92,12.9 57.91,12.9 58.62,12.19 62.89,12.19 63.2,12.5 63.2,15.34 64.62,16.76 L1.1 | v52.02,12.19 52.63,12.19 | v49.17,20.93 49.38,21.13 50.8,21.13 R4.1 51.25,21.42 U11.5 52.83,21.35 52.83,20.73 53.44,20.12 55.17,20.12 56.12,21.07 C29.1 56.08,21.13 v56.08,23.37 | v40.44,37.39 31.09,37.39 30.89,37.19 C3.1 30.62,37.35 U4.1 32.72,35.15 32.72,34.75 32.51,34.54 v31.29,34.54 | 52.63,30.18 v52.63,26.82 | v22.55,15.65 22.55,15.36 | 64.82,37.59 U2.5 | 64.82,37.59 64.41,38 64.41,38.71 64.62,38.91 65.33,38.91 65.47,39.05 C1.1
  Bottom 0.254: v52.02,12.19 52.02,18.9 49.99,20.93 v49.17,20.93 | v48.36,37.39 v40.44,37.39 | v52.63,26.82 v56.08,23.37 | v22.55,15.65 23.16,15.65 31.5,23.98 31.5,34.34 v31.29,34.54
VCC2
  Top 0.254: U1.4 7.24,31.21 8.23,32.21 10.16,32.21 11.28,31.09 11.28,27.51 U1.6 11.24,24.41 C2.1 15.24,24.38 19,20.62 Q3.3

### Text on the board
tPlace: SmartCitizen DVK | Designed in Barcelona | www.smartcitizen.me